# Altium project Cubesat_PDM.PrjPcb (part 2 of 3)

## Sheet 3V3_Supply.SchDoc
size 297 x 209 mm; SheetNumber: 7; SheetTotal: 11
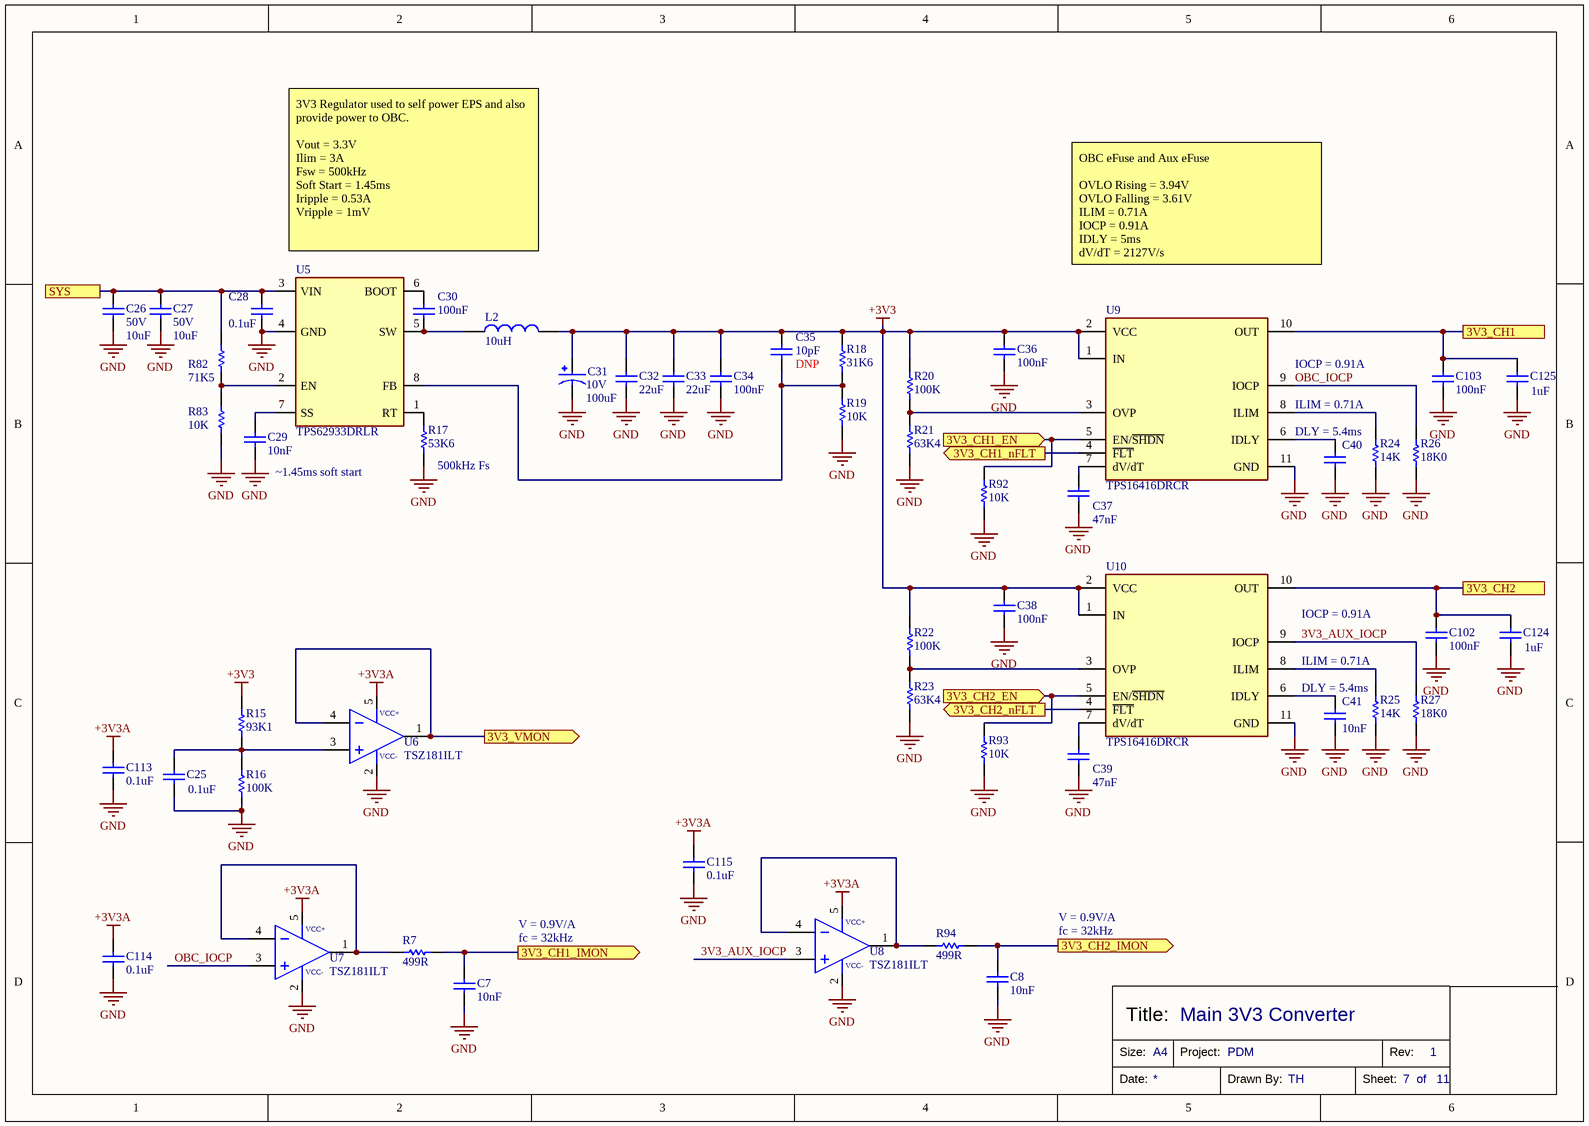
[diagram p5: 3V3_Supply.SchDoc]

### Parts
C7  Capacitance: 10nF  [CAPC0805X060]  (hidden comment: CL21B103KBANNNC)
C8  Capacitance: 10nF  [CAPC0805X060]  (hidden comment: CL21B103KBANNNC)
C25  Capacitance: 0.1uF  [CAPC0805X060]  (hidden comment: CL21B104KACNNNC)
C26  Voltage Rating: 50V  Capacitance: 10uF  [CAPC1210X090]  (hidden comment: CL32B106KBJNNNE)
C27  Voltage Rating: 50V  Capacitance: 10uF  [CAPC1210X090]  (hidden comment: CL32B106KBJNNNE)
C28  Capacitance: 0.1uF  [CAPC0402X020]  (hidden comment: CL05B104KB5NNNC)
C29  Capacitance: 10nF  [CAPC0805X060]  (hidden comment: CL21B103KBANNNC)
C30  Capacitance: 100nF  [CAPC0603X040]  (hidden comment: C0603C104K5RACTU)
C31  Voltage Rating: 10V  Capacitance: 100uF  [2312 Tantalum]  (hidden comment: TPSC107K010R0100)
C32  Capacitance: 22uF  [CAPC0805X060]  (hidden comment: GRM21BZ71A226ME15L)
C33  Capacitance: 22uF  [CAPC0805X060]  (hidden comment: GRM21BZ71A226ME15L)
C34  Capacitance: 100nF  [CAPC0603X040]  (hidden comment: C0603C104K5RACTU)
C35  Capacitance: 10pF  [CAPC0603X040]  (hidden comment: C0603C104K5RACTU)
C36  Capacitance: 100nF  [CAPC0603X040]  (hidden comment: C0603C104K5RACTU)
C37  Capacitance: 47nF  [CAPC0805X060]  (hidden comment: CL21B473KBCNNNC)
C38  Capacitance: 100nF  [CAPC0603X040]  (hidden comment: C0603C104K5RACTU)
C39  Capacitance: 47nF  [CAPC0805X060]  (hidden comment: CL21B473KBCNNNC)
C40  CL21B103KBANNNC  [CAPC0805X060]  (value not drawn)
C41  Capacitance: 10nF  [CAPC0805X060]  (hidden comment: CL21B103KBANNNC)
C102  Capacitance: 100nF  [CAPC0603X040]  (hidden comment: C0603C104K5RACTU)
C103  Capacitance: 100nF  [CAPC0603X040]  (hidden comment: C0603C104K5RACTU)
C113  Capacitance: 0.1uF  [CAPC0603X040]  (hidden comment: C0603C104K5RACTU)
C114  Capacitance: 0.1uF  [CAPC0603X040]  (hidden comment: C0603C104K5RACTU)
C115  Capacitance: 0.1uF  [CAPC0603X040]  (hidden comment: C0603C104K5RACTU)
C124  Capacitance: 1uF  [CAPC0805X060]  (hidden comment: CL21B105KAFNNNE)
C125  Capacitance: 1uF  [CAPC0805X060]  (hidden comment: CL21B105KAFNNNE)
L2  Inductance: 10uH  [1274AS-H-100M=P3]  (hidden comment: 1274AS-H-100M=P3)
R7  Resistance: 499R  [RESC0805]  (hidden comment: RMCF0805FT499R)
R15  Resistance: 93K1  [RESC0603]  (hidden comment: RMCF0603FT93K1)
R16  Resistance: 100K  [RESC0603]  (hidden comment: RMCF0603FT100K)
R17  Resistance: 53K6  [RESC0805]  (hidden comment: RMCF0805FT53K6)
R18  Resistance: 31K6  [RESC0603]  (hidden comment: RMCF0603FT31K6)
R19  Resistance: 10K  [RESC0603]  (hidden comment: RMCF0603FT10K0)
R20  Resistance: 100K  [RESC0805]  (hidden comment: RMCF0805FG100K)
R21  Resistance: 63K4  [RESC0805]  (hidden comment: RMCF0805FT63K4)
R22  Resistance: 100K  [RESC0805]  (hidden comment: RMCF0805FG100K)
R23  Resistance: 63K4  [RESC0805]  (hidden comment: RMCF0805FT63K4)
R24  Resistance: 14K  [RESC0805]  (hidden comment: RMCF0805FT14K0)
R25  Resistance: 14K  [RESC0805]  (hidden comment: RMCF0805FT14K0)
R26  Resistance: 18K0  [RESC0805]  (hidden comment: RMCF0805FT18K0)
R27  Resistance: 18K0  [RESC0805]  (hidden comment: RMCF0805FT18K0)
R82  Resistance: 71K5  [RESC0805]  (hidden comment: RMCF0805FT71K5)
R83  Resistance: 10K  [RESC0603]  (hidden comment: RMCF0603FT10K0)
R92  Resistance: 10K  [RESC0805]  (hidden comment: RMCF0805FT10K0)
R93  Resistance: 10K  [RESC0805]  (hidden comment: RMCF0805FT10K0)
R94  Resistance: 499R  [RESC0805]  (hidden comment: RMCF0805FT499R)
U5  TPS62933DRLR  [SOT-583]
U6  TSZ181ILT  [SOT23-5 IC]
U7  TSZ181ILT  [SOT23-5 IC]
U8  TSZ181ILT  [SOT23-5 IC]
U9  Part Number: TPS16416DRCR  [TPS1641]  (hidden comment: TPS16410DRCR)
U10  Part Number: TPS16416DRCR  [TPS1641]  (hidden comment: TPS16410DRCR)

### Ports
3V3_CH1 (see PDM[6A], PC104[4B], PC104[5B]), 3V3_CH1_EN (in, see PDM[5A], Controller[3D]), 3V3_CH1_IMON (out, see PDM[5A], Controller[1B]), 3V3_CH1_nFLT (out, see PDM[5A], Controller[3D]), 3V3_CH2 (see PDM[6A], PC104[4B], PC104[5B]), 3V3_CH2_EN (in, see PDM[5A], Controller[3D]), 3V3_CH2_IMON (out, see PDM[5A], Controller[1B]), 3V3_CH2_nFLT (out, see PDM[5A], Controller[3D]), 3V3_VMON (out, see PDM[5A], Controller[3B]), SYS (see PDM[5A], 5V_Supply[1A], 6V_Supply[1B], 12V_Supply[1A], PC104[4C], PC104[5C])

### Nets
+3V3: C31.1 C32.2 C33.2 C34.2 C35.2 C36.2 C38.2 L2.2 R15.2 R18.2 R20.2 R22.2 U9.1(IN) U9.2(VCC) U10.1(IN) U10.2(VCC)
+3V3A: C113.2 C114.2 C115.2 U6.5(VCC+) U7.5(VCC+) U8.5(VCC+)
GND: C7.1 C8.1 C25.1 C26.1 C27.1 C28.1 C29.1 C31.2 C32.1 C33.1 C34.1 C36.1 C37.1 C38.1 C39.1 C40.1 C41.1 C102.1 C103.1 C113.1 C114.1 C115.1 C124.1 C125.1 R16.1 R17.1 R19.1 R21.1 R23.1 R24.1 R25.1 R26.1 R27.1 R83.1 R92.1 R93.1 U5.4(GND) U6.2(VCC-) U7.2(VCC-) U8.2(VCC-) U9.11(GND) U10.11(GND)
3V3_AUX_IOCP: R27.2 U8.3(IN+) U10.9(IOCP)
OBC_IOCP: R26.2 U7.3(IN+) U9.9(IOCP)
NetC7_2: C7.2 R7.2 ; port 3V3_CH1_IMON
NetC8_2: C8.2 R94.2 ; port 3V3_CH2_IMON
NetC25_2: C25.2 R15.1 R16.2 U6.3(IN+)
NetC26_2: C26.2 C27.2 C28.2 R82.2 U5.3(VIN) ; port SYS
NetC29_2: C29.2 U5.7(SS)
NetC30_1: C30.1 L2.1 U5.5(SW)
NetC30_2: C30.2 U5.6(BOOT)
NetC35_1: C35.1 R18.1 R19.2 U5.8(FB)
NetC37_2: C37.2 U9.7(dV/dT)
NetC39_2: C39.2 U10.7(dV/dT)
NetC40_2: C40.2 U9.6(IDLY)
NetC41_2: C41.2 U10.6(IDLY)
NetC102_2: C102.2 C124.2 U10.10(OUT) ; port 3V3_CH2
NetC103_2: C103.2 C125.2 U9.10(OUT) ; port 3V3_CH1
NetR7_1: R7.1 U7.1(OUT) U7.4(IN-)
NetR17_2: R17.2 U5.1(RT)
NetR20_1: R20.1 R21.2 U9.3(OVP)
NetR22_1: R22.1 R23.2 U10.3(OVP)
NetR24_2: R24.2 U9.8(ILIM)
NetR25_2: R25.2 U10.8(ILIM)
NetR82_1: R82.1 R83.2 U5.2(EN)
NetR92_2: R92.2 U9.5(EN/~{SHDN}) ; port 3V3_CH1_EN
NetR93_2: R93.2 U10.5(EN/~{SHDN}) ; port 3V3_CH2_EN
NetR94_1: R94.1 U8.1(OUT) U8.4(IN-)
NetU3_35: U6.1(OUT) U6.4(IN-) ; port 3V3_VMON
NetU3_55: U10.4(~{FLT}) ; port 3V3_CH2_nFLT
NetU3_57: U9.4(~{FLT}) ; port 3V3_CH1_nFLT

### Notes on the sheet
- 3V3 Regulator used to self power EPS and also provide power to OBC.
  Vout = 3.3V
  Ilim = 3A
  Fsw = 500kHz
  Soft Start = 1.45ms
  Iripple = 0.53A
  Vripple = 1mV
- OBC eFuse and Aux eFuse
  OVLO Rising = 3.94V
  OVLO Falling = 3.61V
  ILIM = 0.71A
  IOCP = 0.91A
  IDLY = 5ms
  dV/dT = 2127V/s
- (near C35) DNP
- (near U9) IOCP = 0.91A
- ~1.45ms soft start
- (near R17) 500kHz Fs
- DLY = 5.4ms
- ILIM = 0.71A
- (near U10) IOCP = 0.91A
- V = 0.9V/A
- fc = 32kHz
- Main 3V3 Converter
- Size:
- Title:
- A4
- Project:
- Rev:
- Date:
- Drawn By:
- Sheet:
- of

### Library data of the parts
C7 C8 C29 C40 C41 = CL21B103KBANNNC: as C58 on sheet 12V_Supply; Part Number: CL21B103KBANNNC; Distributor Part Number: 1276-1015-1-ND; Tolerance: 10%; Case Code: 0805; Distributor: Digikey
C25 = CL21B104KACNNNC: as C54 on sheet 12V_Supply; Part Number: CL21B104KACNNNC; Distributor Part Number: 1276-1099-1-ND; Tolerance: 10%; Case Code: 0805; Distributor: Digikey; Voltage Rating: 25V
C26 C27 = CL32B106KBJNNNE: as C55 on sheet 12V_Supply; Manufacturer Part Number: CL32B106KBJNNNE; Distributor Part Number: 1276-3387-1-ND; Tolerance: 10%; Case Code: 1210; Distributor: Digikey
C28 = CL05B104KB5NNNC: as C5 on sheet Controller; Part Number: CL05B104KB5NNNC; Tolerance: 10%; Distributor Part Number: 1276-CL05B104KB5NNNCCT-ND; Case Code: 0402; Distributor: Digikey; Voltage Rating: 50V
C30 C34 C36 C38 C102 C103 C113-C115 = C0603C104K5RACTU: as C16 on sheet Controller; Distributor Part Number: 399-C0603C104K5RACTUCT-ND; Tolerance: 10%; Case Code: 0603; Distributor: Digikey; Voltage Rating: 50V
  C30: Manufacturer Part Number: C0603C104K5RACTU
  C34 C36 C38 C102 C103 C113-C115: Part Number: C0603C104K5RACTU
C31 = TPSC107K010R0100: 100 µF Molded Tantalum Capacitors 10 V 2312 (6032 Metric) 100mOhm; Part Number: TPSC107K010R0100; Distributor: Digikey; Distributor Part Number: 478-1765-1-ND; ESR: 100mOhm; Operating Temperature: -55°C ~ 125°C
C32 C33 = GRM21BZ71A226ME15L: 22 µF ±20% 10V Ceramic Capacitor X7R 0805 (2012 Metric); Tolerance: 10%; Part Number: GRM21BZ71A226ME15L; Distributor Part Number: 490-GRM21BZ71A226ME15LCT-ND; Case Code: 0805; Distributor: Digikey; Voltage Rating: 10V
C35 = C0603C100J5GACTU: as C64 on sheet 12V_Supply; Part Number: C0603C100J5GACTU; Distributor Part Number: 399-C0603C100J5GACTUCT-ND; Case Code: 0603; Distributor: Digikey; Voltage Rating: 50V
C37 C39 = CL21B473KBCNNNC: as C67 on sheet 12V_Supply; Part Number: CL21B473KBCNNNC; Distributor Part Number: 1276-1250-1-ND; Tolerance: 10%; Case Code: 0805; Distributor: Digikey
C124 C125 = CL21B105KAFNNNE: as C109 on sheet 12V_Supply; Part Number: CL21B105KAFNNNE; Distributor Part Number: 1276-1066-1-ND; Tolerance: 10%; Case Code: 0805; Distributor: Digikey; Voltage Rating: 25V
L2 = 1274AS-H-100M=P3: as L4 on sheet 12V_Supply; Part Number: 1274AS-H-100M=P3; Distributor Part Number: 490-10846-1-ND; Distributor: Digikey; DCR: 30.4mOhm
R7 R94 = RMCF0805FT499R: as R96 on sheet 12V_Supply; Part Number: RMCF0805FT499R; Tolerance: 1%; Distributor Part Number: RMCF0805FT499RCT-ND; Distributor: Digikey; Case Code: 0805
R15 = RMCF0603FT93K1: 93.1 kOhms ±1% 0.1W, 1/10W Chip Resistor 0603 (1608 Metric) Automotive AEC-Q200 Thick Film; Part Number: RMCF0603FT93K1; Tolerance: 1%; Distributor: Digikey; Distributor Part Number: RMCF0603FT93K1CT-ND; Case Code: 0603
R16 = RMCF0603FT100K: 100 kOhms ±1% 0.1W, 1/10W Chip Resistor 0603 (1608 Metric) Automotive AEC-Q200 Thick Film; Part Number: RMCF0603FT100K; Tolerance: 1%; Distributor: Digikey; Distributor Part Number: RMCF0603FT100KCT-ND; Case Code: 0603
R17 = RMCF0805FT53K6: as R44 on sheet 12V_Supply; Part Number: RMCF0805FT53K6; Tolerance: 1%; Distributor Part Number: RMCF0805FT53K6CT-ND; Distributor: Digikey; Case Code: 0805
R18 = RMCF0603FT31K6: 31.6 kOhms ±1% 0.1W, 1/10W Chip Resistor 0603 (1608 Metric) Automotive AEC-Q200 Thick Film; Part Number: RMCF0603FT31K6; Tolerance: 1%; Distributor: Digikey; Distributor Part Number: RMCF0603FT31K6CT-ND; Case Code: 0603
R19 R83 = RMCF0603FT10K0: as R74 on sheet I2C_Buffer; Tolerance: 1%; Distributor Part Number: RMCF0603FT10K0CT-ND; Distributor: Digikey; Case Code: 0603; Part Number: RMCF0603FT10K0
R20 R22 = RMCF0805FG100K: as R47 on sheet 12V_Supply; Part Number: RMCF0805FG100K; Tolerance: 1%; Distributor Part Number: RMCF0805FG100KCT-ND; Distributor: Digikey; Case Code: 0805
R21 R23 = RMCF0805FT63K4: 63.4 kOhms ±1% 0.125W, 1/8W Chip Resistor 0805 (2012 Metric) Automotive AEC-Q200 Thick Film; Part Number: RMCF0805FT63K4; Tolerance: 1%; Distributor Part Number: RMCF0805FT63K4CT-ND; Distributor: Digikey; Case Code: 0805
R24 R25 = RMCF0805FT14K0: 14 kOhms ±1% 0.125W, 1/8W Chip Resistor 0805 (2012 Metric) Automotive AEC-Q200 Thick Film; Part Number: RMCF0805FT14K0; Tolerance: 1%; Distributor Part Number: RMCF0805FT14K0CT-ND; Distributor: Digikey; Case Code: 0805
R26 R27 = RMCF0805FT18K0: 18 kOhms ±1% 0.125W, 1/8W Chip Resistor 0805 (2012 Metric) Automotive AEC-Q200 Thick Film; Part Number: RMCF0805FT18K0; Tolerance: 1%; Distributor Part Number: RMCF0805FT18K0CT-ND; Distributor: Digikey; Case Code: 0805
R82 = RMCF0805FT71K5: 71.5 kOhms ±1% 0.125W, 1/8W Chip Resistor 0805 (2012 Metric) Automotive AEC-Q200 Thick Film; Part Number: RMCF0805FT71K5; Tolerance: 1%; Distributor Part Number: RMCF0805FT71K5CT-ND; Distributor: Digikey; Case Code: 0805
R92 R93 = RMCF0805FT10K0: as R8 on sheet Controller; Part Number: RMCF0805FT10K0; Tolerance: 1%; Distributor Part Number: RMCF0805FT10K0CT-ND; Distributor: Digikey; Case Code: 0805
U5 = TPS62933DRLR: as U15 on sheet 12V_Supply; Part Number: TPS62933DRLR; Distributor Part Number: 296-TPS62933DRLRCT-ND; Distributor: Digikey; Operating Temperature: -40°C ~ 150°C (TJ); Current Output: 3A; Voltage - Output (Min): 0.8V
U6-U8 = TSZ181ILT: as U16 on sheet 12V_Supply; Part Number: TSZ181ILT; Distributor: Digikey; Distributor Part Number: 497-18084-1-ND; Operating Temperature: -40°C ~ 125°C
U9 U10 = TPS16410DRCR: as U19 on sheet 12V_Supply; Distributor Part Number: 296-TPS16410DRCRCT-ND; Package: 10-VSON (3x3); Distributor: Digikey; Operating Temperature: -40C ~ 125C

## Sheet 6V_Supply.SchDoc
size 297 x 209 mm; SheetNumber: 6; SheetTotal: 11
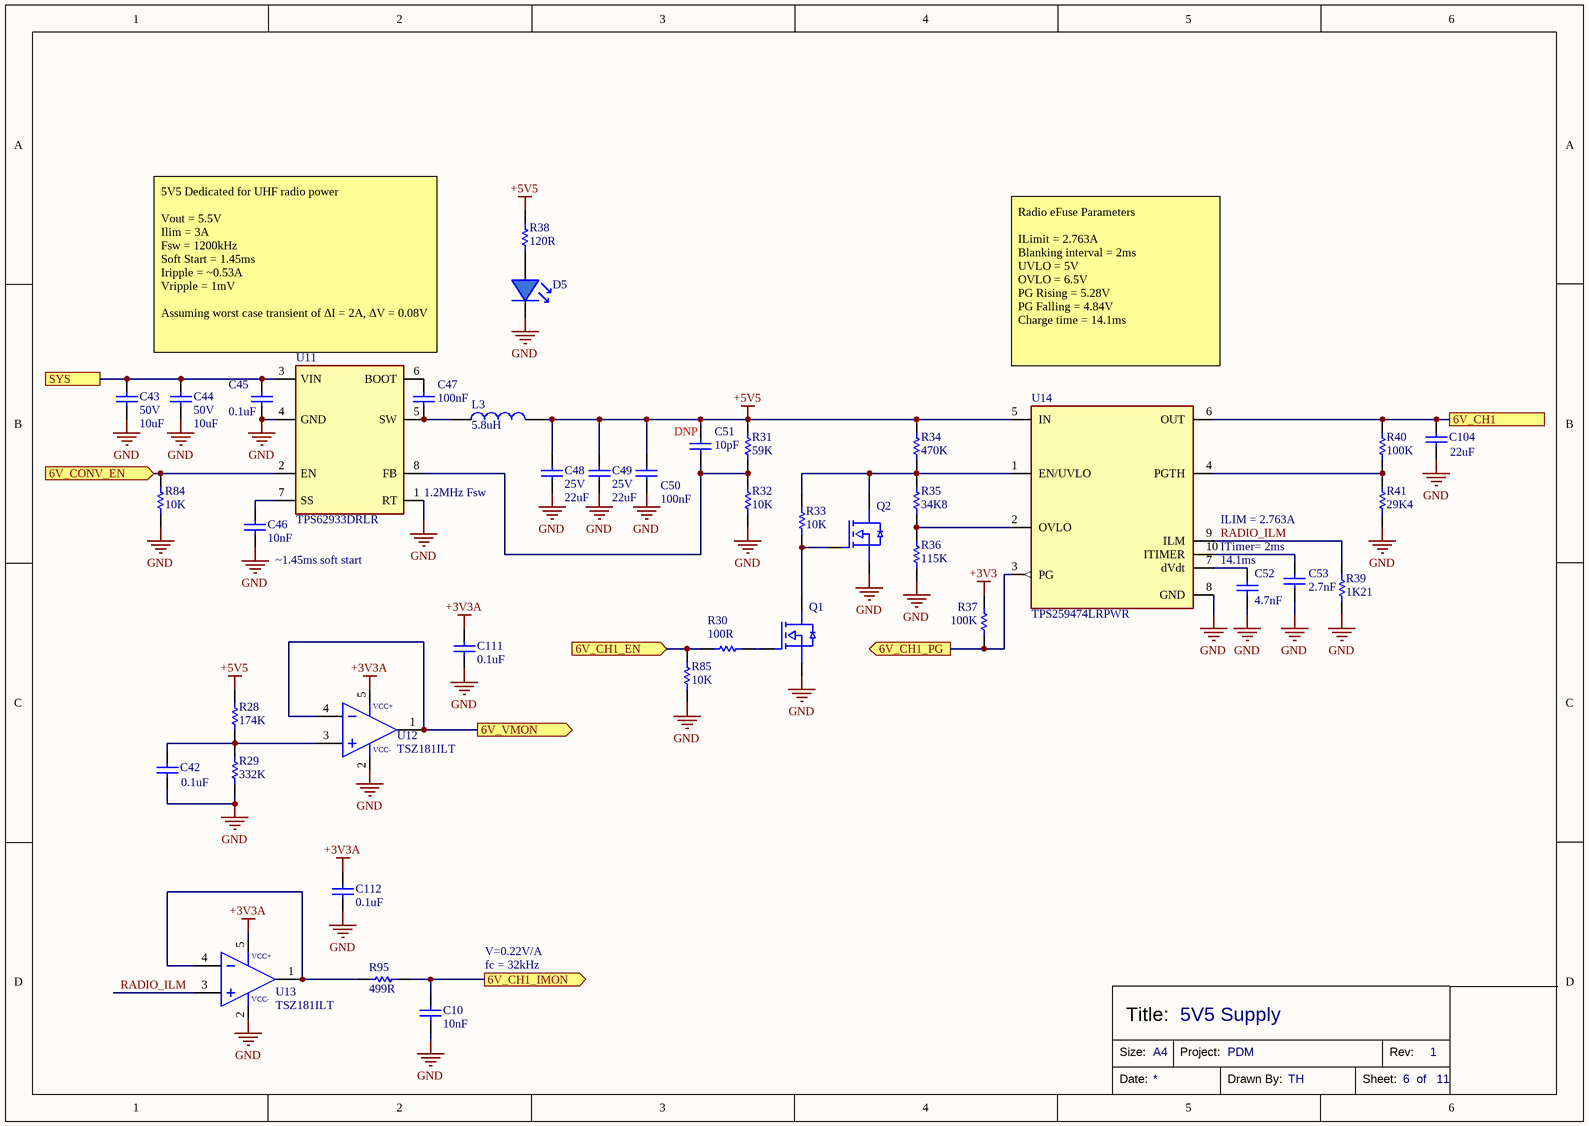
[diagram p6: 6V_Supply.SchDoc]

### Parts
C10  Capacitance: 10nF  [CAPC0805X060]  (hidden comment: CL21B103KBANNNC)
C42  Capacitance: 0.1uF  [CAPC0805X060]  (hidden comment: CL21B104KACNNNC)
C43  Voltage Rating: 50V  Capacitance: 10uF  [CAPC1210X090]  (hidden comment: CL32B106KBJNNNE)
C44  Voltage Rating: 50V  Capacitance: 10uF  [CAPC1210X090]  (hidden comment: CL32B106KBJNNNE)
C45  Capacitance: 0.1uF  [CAPC0402X020]  (hidden comment: CL05B104KB5NNNC)
C46  Capacitance: 10nF  [CAPC0805X060]  (hidden comment: CL21B103KBANNNC)
C47  Capacitance: 100nF  [CAPC0603X040]  (hidden comment: C0603C104K5RACTU)
C48  Voltage Rating: 25V  Capacitance: 22uF  [CAPC1210X090]  (hidden comment: CL32B226KAJNNNE)
C49  Voltage Rating: 25V  Capacitance: 22uF  [CAPC1210X090]  (hidden comment: CL32B226KAJNNNE)
C50  Capacitance: 100nF  [CAPC0603X040]  (hidden comment: C0603C104K5RACTU)
C51  Capacitance: 10pF  [CAPC0603X040]  (hidden comment: C0603C104K5RACTU)
C52  Capacitance: 4.7nF  [CAPC0805X060]  (hidden comment: CL21B105KAFNNNE)
C53  Capacitance: 2.7nF  [CAPC0805X060]  (hidden comment: GRM2165C1H272JA01D)
C104  Capacitance: 22uF  [CAPC1210X090]  (hidden comment: CL32B226MOJNNNE)
C111  Capacitance: 0.1uF  [CAPC0603X040]  (hidden comment: C0603C104K5RACTU)
C112  Capacitance: 0.1uF  [CAPC0603X040]  (hidden comment: C0603C104K5RACTU)
D5  LSM0805463V  [LEDB_0805]  (value not drawn)
L3  744316560  [744316560]  (value not drawn)
Q1  T2N7002AK,LM  [SOT23-3 MOSFET]  (value not drawn)
Q2  T2N7002AK,LM  [SOT23-3 MOSFET]  (value not drawn)
R28  Resistance: 174K  [RESC0603]  (hidden comment: RMCF0603FT174K)
R29  Resistance: 332K  [RESC0805]  (hidden comment: RMCF0805FT332K)
R30  Resistance: 100R  [RESC0805]  (hidden comment: RMCF0805FT100R)
R31  Resistance: 59K  [RESC0603]  (hidden comment: RMCF0603FT59K0)
R32  Resistance: 10K  [RESC0603]  (hidden comment: RMCF0603FT10K0)
R33  Resistance: 10K  [RESC0805]  (hidden comment: RMCF0805FT10K0)
R34  Resistance: 470K  [RESC0603]  (hidden comment: RMCF0603FT470K)
R35  Resistance: 34K8  [RESC0805]  (hidden comment: RMCF0805FT34K8)
R36  Resistance: 115K  [RESC0805]  (hidden comment: RMCF0805FT115K)
R37  Resistance: 100K  [RESC0805]  (hidden comment: RMCF0805FG100K)
R38  Resistance: 120R  [RESC0805]  (hidden comment: RMCF0805FT120R)
R39  Resistance: 1K21  [RESC0805]  (hidden comment: RMCF0805FT1K21)
R40  Resistance: 100K  [RESC0805]  (hidden comment: RMCF0805FG100K)
R41  Resistance: 29K4  [RESC0805]  (hidden comment: RMCF0805FT29K4)
R84  Resistance: 10K  [RESC0805]  (hidden comment: RMCF0805FT10K0)
R85  Resistance: 10K  [RESC0805]  (hidden comment: RMCF0805FT10K0)
R95  Resistance: 499R  [RESC0805]  (hidden comment: RMCF0805FT499R)
U11  TPS62933DRLR  [SOT-583]
U12  TSZ181ILT  [SOT23-5 IC]
U13  TSZ181ILT  [SOT23-5 IC]
U14  TPS259474LRPWR  [VFQFN-10]

### Ports
6V_CH1 (see PDM[6B], PC104[4C], PC104[5C]), 6V_CH1_EN (in, see PDM[5C], Controller[3C]), 6V_CH1_IMON (out, see PDM[5C], Controller[1B]), 6V_CH1_PG (out, see PDM[5C], Controller[3C]), 6V_CONV_EN (in, see PDM[5C], Controller[3B]), 6V_VMON (out, see PDM[5C], Controller[1B]), SYS (see PDM[5B], 3V3_Supply[1B], 5V_Supply[1A], 12V_Supply[1A], PC104[4C], PC104[5C])

### Nets
+3V3: R37.2
+3V3A: C111.2 C112.2 U12.5(VCC+) U13.5(VCC+)
+5V5: C48.2 C49.2 C50.2 C51.2 L3.2 R28.2 R31.2 R34.2 R38.2 U14.5(IN)
GND: C10.1 C42.1 C43.1 C44.1 C45.1 C46.1 C48.1 C49.1 C50.1 C52.1 C53.1 C104.1 C111.1 C112.1 D5.K Q1.S Q2.S R29.1 R32.1 R36.1 R39.1 R41.1 R84.1 R85.1 U11.1(RT) U11.4(GND) U12.2(VCC-) U13.2(VCC-) U14.8(GND)
RADIO_ILM: R39.2 U13.3(IN+) U14.9(ILM)
NetC10_2: C10.2 R95.2 ; port 6V_CH1_IMON
NetC26_2: C43.2 C44.2 C45.2 U11.3(VIN) ; port SYS
NetC42_2: C42.2 R28.1 R29.2 U12.3(IN+)
NetC46_2: C46.2 U11.7(SS)
NetC47_1: C47.1 L3.1 U11.5(SW)
NetC47_2: C47.2 U11.6(BOOT)
NetC51_1: C51.1 R31.1 R32.2 U11.8(FB)
NetC52_2: C52.2 U14.7(dVdt)
NetC53_2: C53.2 U14.10(ITIMER)
NetC104_2: C104.2 R40.2 U14.6(OUT) ; port 6V_CH1
NetD5_A: D5.A R38.1
NetQ1_D: Q1.D Q2.G R33.1
NetQ1_G: Q1.G R30.1
NetQ2_D: Q2.D R33.2 R34.1 R35.2 U14.1(EN/UVLO)
NetR30_2: R30.2 R85.2 ; port 6V_CH1_EN
NetR35_1: R35.1 R36.2 U14.2(OVLO)
NetR37_1: R37.1 U14.3(PG) ; port 6V_CH1_PG
NetR40_1: R40.1 R41.2 U14.4(PGTH)
NetR84_2: R84.2 U11.2(EN) ; port 6V_CONV_EN
NetR95_1: R95.1 U13.1(OUT) U13.4(IN-)
NetU3_23: U12.1(OUT) U12.4(IN-) ; port 6V_VMON

### Notes on the sheet
- 5V5 Dedicated for UHF radio power
  Vout = 5.5V
  Ilim = 3A
  Fsw = 1200kHz
  Soft Start = 1.45ms
  Iripple = ~0.53A
  Vripple = 1mV
  Assuming worst case transient of ΔI = 2A, ΔV = 0.08V
- Radio eFuse Parameters
  ILimit = 2.763A
  Blanking interval = 2ms
  UVLO = 5V
  OVLO = 6.5V
  PG Rising = 5.28V
  PG Falling = 4.84V
  Charge time = 14.1ms
- (near L3) 5.8uH
- (near C51) DNP
- (near U11) 1.2MHz Fsw
- (near U14) ILIM = 2.763A
- (near C46) ~1.45ms soft start
- ITimer= 2ms
- (near C52) 14.1ms
- V=0.22V/A
- fc = 32kHz
- 5V5 Supply
- Size:
- Title:
- A4
- Project:
- Rev:
- Date:
- Drawn By:
- Sheet:
- of

### Library data of the parts
C10 C46 = CL21B103KBANNNC: as C58 on sheet 12V_Supply; Part Number: CL21B103KBANNNC; Distributor Part Number: 1276-1015-1-ND; Tolerance: 10%; Case Code: 0805; Distributor: Digikey
C42 = CL21B104KACNNNC: as C54 on sheet 12V_Supply; Part Number: CL21B104KACNNNC; Distributor Part Number: 1276-1099-1-ND; Tolerance: 10%; Case Code: 0805; Distributor: Digikey; Voltage Rating: 25V
C43 C44 = CL32B106KBJNNNE: as C55 on sheet 12V_Supply; Manufacturer Part Number: CL32B106KBJNNNE; Distributor Part Number: 1276-3387-1-ND; Tolerance: 10%; Case Code: 1210; Distributor: Digikey
C45 = CL05B104KB5NNNC: as C5 on sheet Controller; Part Number: CL05B104KB5NNNC; Tolerance: 10%; Distributor Part Number: 1276-CL05B104KB5NNNCCT-ND; Case Code: 0402; Distributor: Digikey; Voltage Rating: 50V
C47 C50 C111 C112 = C0603C104K5RACTU: as C16 on sheet Controller; Distributor Part Number: 399-C0603C104K5RACTUCT-ND; Tolerance: 10%; Case Code: 0603; Distributor: Digikey; Voltage Rating: 50V
  C47: Manufacturer Part Number: C0603C104K5RACTU
  C50 C111 C112: Part Number: C0603C104K5RACTU
C48 C49 = CL32B226KAJNNNE: as C60 on sheet 12V_Supply; Part Number: CL32B226KAJNNNE; Distributor Part Number: 1276-3392-1-ND; Tolerance: 10%; Case Code: 1210; Distributor: Digikey
C51 = C0603C100J5GACTU: as C64 on sheet 12V_Supply; Part Number: C0603C100J5GACTU; Distributor Part Number: 399-C0603C100J5GACTUCT-ND; Case Code: 0603; Distributor: Digikey; Voltage Rating: 50V
C52 = CL21B472KBANNNC: 4.7nF ±10% 50V Ceramic Capacitor X7R 0805 (2012 Metric); Voltage Rating: 25V; Part Number: CL21B472KBANNNC; Distributor Part Number: 1276-1155-1-ND; Tolerance: 10%; Case Code: 0805; Distributor: Digikey
C53 = GRM2165C1H272JA01D: 2.7nF ±5% 50V Ceramic Capacitor C0G, NP0 0805 (2012 Metric); Manufacturer Part Number: GRM2165C1H272JA01D; Distributor Part Number: 490-1630-1-ND; Tolerance: 5%; Case Code: 0805; Distributor: Digikey; Voltage Rating: 50V
C104 = CL32B226MOJNNNE: 22 µF ±20% 16V Ceramic Capacitor X7R 1210 (3225 Metric); Tolerance: 10%; Voltage Rating: 50V; Part Number: CL32B226MOJNNNE; Distributor Part Number: 1276-3395-1-ND; Case Code: 1210; Distributor: Digikey
D5 = LEDB0805: as D6 on sheet 12V_Supply; Manufacturer Part Number: LSM0805463V; Distributor Part Number: 28-LSM0805463VCT-ND; Colour: Blue; Operating Temperature: *; Voltage - Forward: 3V; Distributor: Digikey
L3 = 744316560: Inductor 5.6uH 4.5A Shielded 28.5mOhm SMD; Saturation Current: 4.6A; Part Number: 744316560; Distributor Part Number: 732-6183-1-ND; Distributor: Digikey; Current Rating: 4.5A; DCR: 28.5mOhm
Q1 Q2 = T2N7002AK,LM: N-Channel 60 V 200mA (Ta) 320mW (Ta) Surface Mount SOT-23-3; Drain to Source Voltage: 60V; Rds On (Max) @ Id, Vgs: 3.9ohm; Vgs(th) (Max) @ Id: 2.1V @ 250µA; (Id) @ 25°C: 200mA; Vgs (Max): *; Power Dissipation (Max): 320mW (Ta); Operating Temperature: -55C - 150C; Manufacturer Part Number: T2N7002AK,LM; Part Number: T2N7002AK,LM; Distributor: Digikey; Distributor Part Number: T2N7002AKLMCT-ND
R28 = RMCF0603FT174K: 174 kOhms ±1% 0.1W, 1/10W Chip Resistor 0603 (1608 Metric) Automotive AEC-Q200 Thick Film; Manufacturer Part Number: RMCF0603FT174K; Tolerance: 1%; Distributor: Digikey; Distributor Part Number: RMCF0603FT174KCT-ND; Case Code: 0603
R29 = RMCF0805FT332K: as R42 on sheet 12V_Supply; Part Number: RMCF0805FT332K; Tolerance: 1%; Distributor Part Number: RMCF0805FT332KCT-ND; Distributor: Digikey; Case Code: 0805
R30 = RMCF0805FT100R: 100 Ohms ±1% 0.125W, 1/8W Chip Resistor 0805 (2012 Metric) Automotive AEC-Q200 Thick Film; Part Number: RMCF0805FT100R; Tolerance: 1%; Distributor Part Number: RMCF0805FT100RCT-ND; Distributor: Digikey; Case Code: 0805
R31 = RMCF0603FT59K0: 59 kOhms ±1% 0.1W, 1/10W Chip Resistor 0603 (1608 Metric) Automotive AEC-Q200 Thick Film; Part Number: RMCF0603FT59K0; Tolerance: 1%; Distributor Part Number: RMCF0603FT59K0CT-ND; Distributor: Digikey; Case Code: 0603
R32 = RMCF0603FT10K0: as R74 on sheet I2C_Buffer; Tolerance: 1%; Distributor Part Number: RMCF0603FT10K0CT-ND; Distributor: Digikey; Case Code: 0603; Part Number: RMCF0603FT10K0
R33 R84 R85 = RMCF0805FT10K0: as R8 on sheet Controller; Part Number: RMCF0805FT10K0; Tolerance: 1%; Distributor Part Number: RMCF0805FT10K0CT-ND; Distributor: Digikey; Case Code: 0805
R34 = RMCF0603FT470K: 470 kOhms ±1% 0.1W, 1/10W Chip Resistor 0603 (1608 Metric) Automotive AEC-Q200 Thick Film; Part Number: RMCF0603FT470K; Tolerance: 1%; Distributor: Digikey; Distributor Part Number: RMCF0603FT470KCT-ND; Case Code: 0603
R35 = RMCF0805FT34K8: 34.8 kOhms ±1% 0.125W, 1/8W Chip Resistor 0805 (2012 Metric) Automotive AEC-Q200 Thick Film; Part Number: RMCF0805FT34K8; Tolerance: 1%; Distributor Part Number: RMCF0805FT34K8CT-ND; Distributor: Digikey; Case Code: 0805
R36 = RMCF0805FT115K: 115 kOhms ±1% 0.125W, 1/8W Chip Resistor 0805 (2012 Metric) Automotive AEC-Q200 Thick Film; Part Number: RMCF0805FT115K; Tolerance: 1%; Distributor Part Number: RMCF0805FT115KCT-ND; Distributor: Digikey; Case Code: 0805
R37 R40 = RMCF0805FG100K: as R47 on sheet 12V_Supply; Part Number: RMCF0805FG100K; Tolerance: 1%; Distributor Part Number: RMCF0805FG100KCT-ND; Distributor: Digikey; Case Code: 0805
R38 = RMCF0805FT120R: as R12 on sheet Controller; Part Number: RMCF0805FT120R; Tolerance: 1%; Distributor Part Number: 738-RMCF0805FT120RCT-ND; Distributor: Digikey; Case Code: 0805
R39 = RMCF0805FT1K21: 1.21 kOhms ±1% 0.125W, 1/8W Chip Resistor 0805 (2012 Metric) Automotive AEC-Q200 Thick Film; Part Number: RMCF0805FT1K21; Tolerance: 1%; Distributor Part Number: RMCF0805FT1K21CT-ND; Distributor: Digikey; Case Code: 0805
R41 = RMCF0805FT29K4: 29.4 kOhms ±1% 0.125W, 1/8W Chip Resistor 0805 (2012 Metric) Automotive AEC-Q200 Thick Film; Part Number: RMCF0805FT29K4; Tolerance: 1%; Distributor Part Number: RMCF0805FT29K4CT-ND; Distributor: Digikey; Case Code: 0805
R95 = RMCF0805FT499R: as R96 on sheet 12V_Supply; Part Number: RMCF0805FT499R; Tolerance: 1%; Distributor Part Number: RMCF0805FT499RCT-ND; Distributor: Digikey; Case Code: 0805
U11 = TPS62933DRLR: as U15 on sheet 12V_Supply; Part Number: TPS62933DRLR; Distributor Part Number: 296-TPS62933DRLRCT-ND; Distributor: Digikey; Operating Temperature: -40°C ~ 150°C (TJ); Current Output: 3A; Voltage - Output (Min): 0.8V
U12 U13 = TSZ181ILT: as U16 on sheet 12V_Supply; Part Number: TSZ181ILT; Distributor: Digikey; Distributor Part Number: 497-18084-1-ND; Operating Temperature: -40°C ~ 125°C
U14 = TPS259474LRPWR: eFuse 5.5A, 2.7V~23V, 28mOhm, Reverse Current Blocking with Input Reverse Polarity Protection; Part Number: TPS259474LRPWR; Distributor: Digikey; Distributor Part Number: 296-TPS259474LRPWRCT-ND; Operating Temperature: -40°C ~ 125°C; Output Current: 5.5A; Voltage Input: 2.7V~23V

## Sheet Ideal_Diode.SchDoc
size 297 x 209 mm; SheetNumber: 3; SheetTotal: 11
Used 4 times, as channels PDM/Ideal_Diode0, PDM/Ideal_Diode1, PDM/Ideal_Diode2, PDM/Ideal_Diode3. Parts and nets are listed once, with the designators drawn on the sheet.
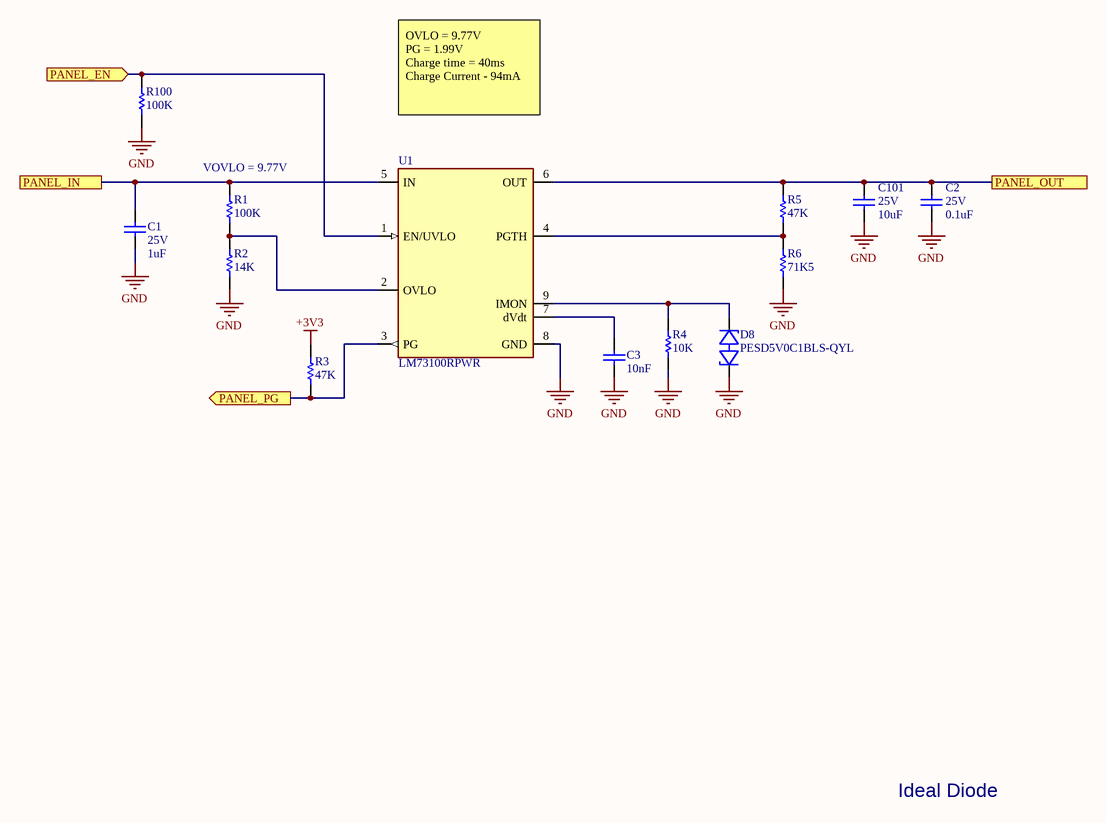
[diagram p7: Ideal_Diode.SchDoc]

### Parts
C1  Voltage Rating: 25V  Capacitance: 1uF  [CAPC0805X060]  (hidden comment: CL21B105KAFNNNE)
C2  Voltage Rating: 25V  Capacitance: 0.1uF  [CAPC0805X060]  (hidden comment: CL21B104KACNNNC)
C3  Capacitance: 10nF  [CAPC0805X060]  (hidden comment: CL21B103KBANNNC)
C101  Voltage Rating: 25V  Capacitance: 10uF  [CAPC0805X060]  (hidden comment: GRM21BZ71E106KE15L)
D8  PESD5V0C1BLS-QYL  [PESD5V0C1BLS-Q]
R1  Resistance: 100K  [RESC0805]  (hidden comment: RMCF0805FG100K)
R2  Resistance: 14K  [RESC0805]  (hidden comment: RMCF0805FT14K0)
R3  Resistance: 47K  [RESC0805]  (hidden comment: RMCF0805FT47K0)
R4  Resistance: 10K  [RESC0805]  (hidden comment: RMCF0805FT10K0)
R5  Resistance: 47K  [RESC0805]  (hidden comment: RMCF0805FT47K0)
R6  Resistance: 71K5  [RESC0805]  (hidden comment: RMCF0805FT71K5)
R100  Resistance: 100K  [RESC0805]  (hidden comment: RMCF0805FG100K)
U1  LM73100RPWR  [VFQFN-10]

### Ports
PANEL_EN (in, see PDM[2B]), PANEL_IN (see PDM[2B]), PANEL_OUT (see PDM[1B]), PANEL_PG (out, see PDM[2B])

### Nets
+3V3: R3.2
GND: C1.1 C2.1 C3.1 C101.1 D8.1 R2.1 R4.1 R6.1 R100.1 U1.8(GND)
PANEL_EN: R100.2 U1.1(EN/UVLO) ; port PANEL_EN
PANEL_IN: C1.2 R1.2 U1.5(IN) ; port PANEL_IN
PANEL_OUT: C2.2 C101.2 R5.2 U1.6(OUT) ; port PANEL_OUT
PANEL_PG: R3.1 U1.3(PG) ; port PANEL_PG
NetC3_2: C3.2 U1.7(dVdt)
NetD8_2: D8.2 R4.2 U1.9(IMON)
NetR1_1: R1.1 R2.2 U1.2(OVLO)
NetR5_1: R5.1 R6.2 U1.4(PGTH)

### Channels
PDM/Ideal_Diode0: designators end in A; ports PANEL_EN=NetR100A_2 PANEL_IN=NetC1A_2 PANEL_OUT=NetC2A_2 PANEL_PG=NetR3A_1
PDM/Ideal_Diode1: designators end in B; ports PANEL_EN=NetR100A_2 PANEL_IN=NetC1A_2 PANEL_OUT=NetC2A_2 PANEL_PG=NetR3A_1
PDM/Ideal_Diode2: designators end in C; ports PANEL_EN=NetR100A_2 PANEL_IN=NetC1A_2 PANEL_OUT=NetC2A_2 PANEL_PG=NetR3A_1
PDM/Ideal_Diode3: designators end in D; ports PANEL_EN=NetR100A_2 PANEL_IN=NetC1A_2 PANEL_OUT=NetC2A_2 PANEL_PG=NetR3A_1

### Notes on the sheet
- OVLO = 9.77V
  PG = 1.99V
  Charge time = 40ms
  Charge Current - 94mA
- (near R1) VOVLO = 9.77V
- Ideal Diode
- Size:
- Title:
- A4
- Project:
- Rev:
- Date:
- Drawn By:
- Sheet:
- of

### Library data of the parts
C1 = CL21B105KAFNNNE: as C109 on sheet 12V_Supply; Part Number: CL21B105KAFNNNE; Distributor Part Number: 1276-1066-1-ND; Tolerance: 10%; Case Code: 0805; Distributor: Digikey
C2 = CL21B104KACNNNC: as C54 on sheet 12V_Supply; Part Number: CL21B104KACNNNC; Distributor Part Number: 1276-1099-1-ND; Tolerance: 10%; Case Code: 0805; Distributor: Digikey
C3 = CL21B103KBANNNC: as C58 on sheet 12V_Supply; Part Number: CL21B103KBANNNC; Distributor Part Number: 1276-1015-1-ND; Tolerance: 10%; Case Code: 0805; Distributor: Digikey
C101 = GRM21BZ71E106KE15L: 10uF ±10% 25V Ceramic Capacitor X7R 0805 (2012 Metric); Manufacturer Part Number: GRM21BZ71E106KE15L; Distributor Part Number: 490-GRM21BZ71E106KE15LCT-ND; Tolerance: 10%; Case Code: 0805; Distributor: Digikey
D8 = PESD5V0C1BLS-QYL: 5.4V (Typ) Clamp 6.5A (8/20µs) Ipp Tvs Diode Surface Mount DFN1006BD-2; Voltage - Reverse Standoff (Typ): 5V (Max); Voltage - Breakdown (Min): 7.5V; Part Number: PESD5V0C1BLS-QYL; Voltage - Clamping (Max) @ Ipp: 5.4V (Typ); Operating Temperature: -55C ~ 150C; ComponentLink1Description: Datasheet; ComponentLink1URL: https://assets.nexperia.com/documents/data-sheet/PESD5V0C1BLS-Q.pdf; Distributor: Digikey; Distributor Part Number: 1727-PESD5V0C1BLS-QYLCT-ND
R1 R100 = RMCF0805FG100K: as R47 on sheet 12V_Supply; Part Number: RMCF0805FG100K; Tolerance: 1%; Distributor Part Number: RMCF0805FG100KCT-ND; Distributor: Digikey; Case Code: 0805
R2 = RMCF0805FT14K0: as R24 on sheet 3V3_Supply; Part Number: RMCF0805FT14K0; Tolerance: 1%; Distributor Part Number: RMCF0805FT14K0CT-ND; Distributor: Digikey; Case Code: 0805
R3 R5 = RMCF0805FT47K0: 47 kOhms ±1% 0.125W, 1/8W Chip Resistor 0805 (2012 Metric) Automotive AEC-Q200 Thick Film; Part Number: RMCF0805FT47K0; Tolerance: 1%; Distributor Part Number: RMCF0805FT47K0CT-ND; Distributor: Digikey; Case Code: 0805
R4 = RMCF0805FT10K0: as R8 on sheet Controller; Part Number: RMCF0805FT10K0; Tolerance: 1%; Distributor Part Number: RMCF0805FT10K0CT-ND; Distributor: Digikey; Case Code: 0805
R6 = RMCF0805FT71K5: as R82 on sheet 3V3_Supply; Part Number: RMCF0805FT71K5; Tolerance: 1%; Distributor Part Number: RMCF0805FT71K5CT-ND; Distributor: Digikey; Case Code: 0805
U1 = LM73100RPWR: Ideal Diode 2.7 - 23 V, 5.5 A with Input Reverse Polarity and / Overvoltage Protection; Current Output: 5.5A; Voltage Supply: 2.7V ~ 23V; Part Number: LM73100RPWR; Distributor Part Number: 296-LM73100RPWRCT-ND; Distributor: Digikey; Operating Temperature: -40°C ~ 125°C (TJ)

## Sheet 5V_Supply.SchDoc
size 297 x 209 mm; SheetNumber: 9; SheetTotal: 11
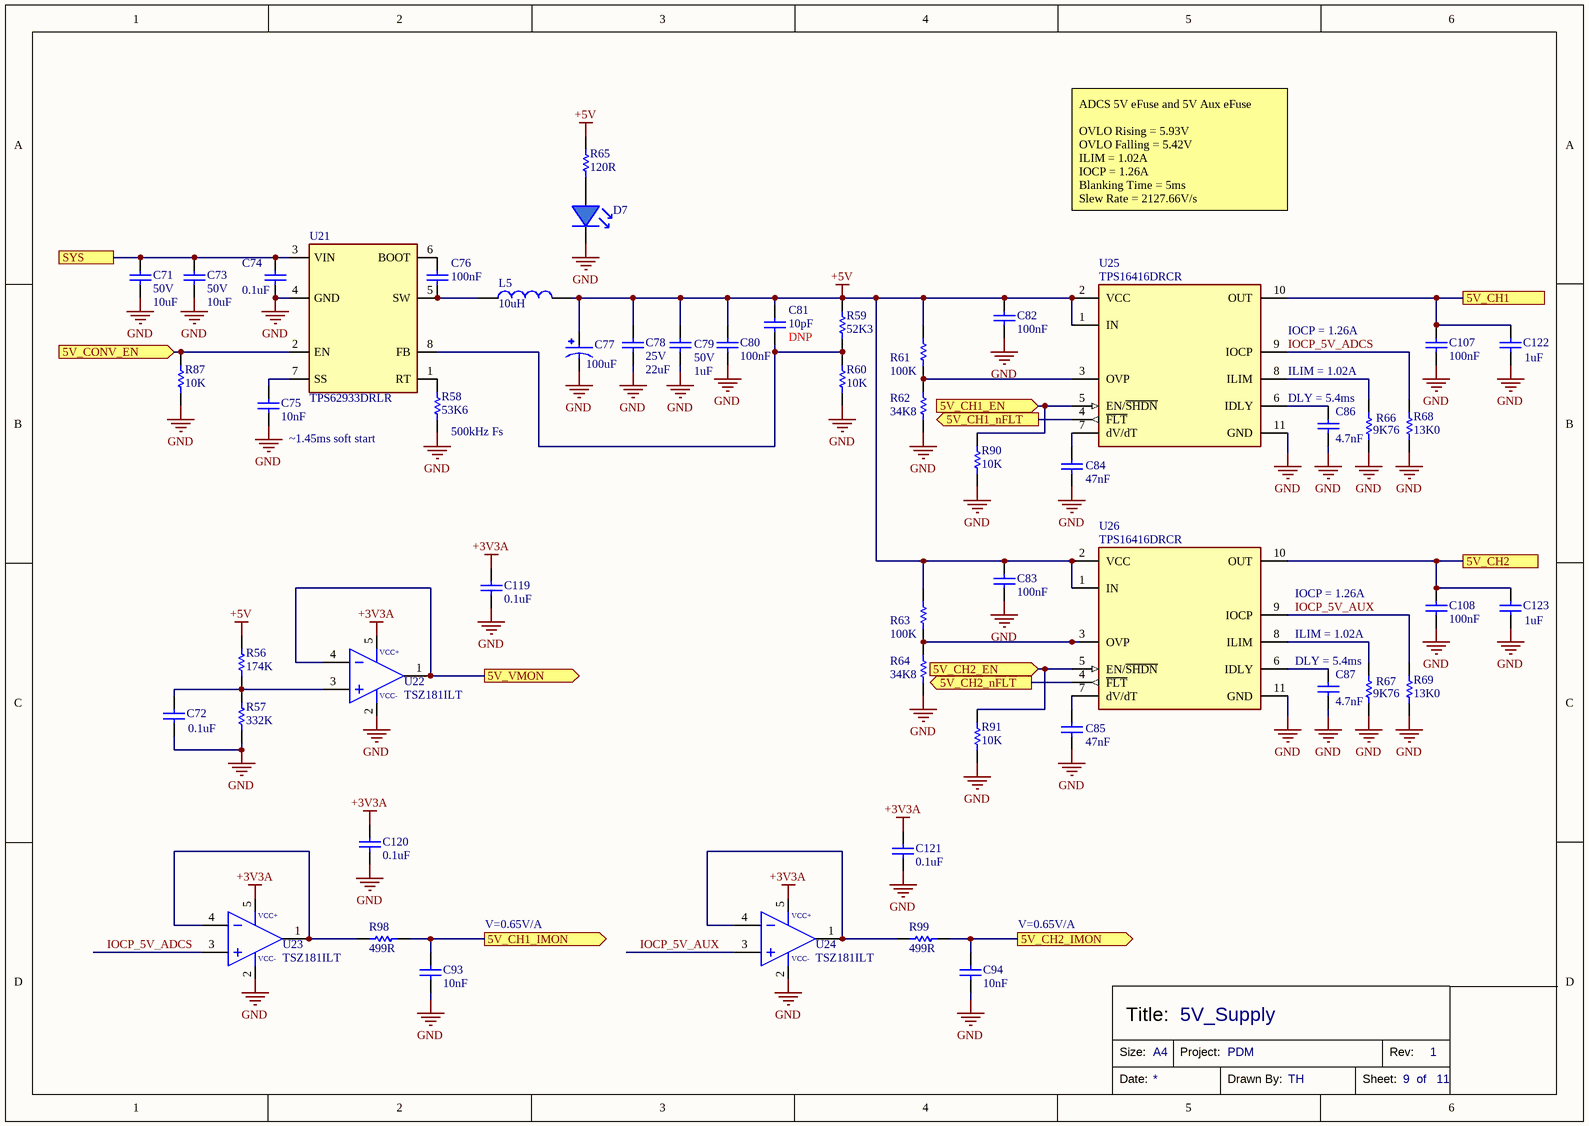
[diagram p8: 5V_Supply.SchDoc]

### Parts
C71  Voltage Rating: 50V  Capacitance: 10uF  [CAPC1210X090]  (hidden comment: CL32B106KBJNNNE)
C72  Capacitance: 0.1uF  [CAPC0805X060]  (hidden comment: CL21B104KACNNNC)
C73  Voltage Rating: 50V  Capacitance: 10uF  [CAPC1210X090]  (hidden comment: CL32B106KBJNNNE)
C74  Capacitance: 0.1uF  [CAPC0402X020]  (hidden comment: CL05B104KB5NNNC)
C75  Capacitance: 10nF  [CAPC0805X060]  (hidden comment: CL21B103KBANNNC)
C76  Capacitance: 100nF  [CAPC0603X040]  (hidden comment: C0603C104K5RACTU)
C77  Capacitance: 100uF  [2312 Tantalum]  (hidden comment: TPSC107K010R0100)
C78  Voltage Rating: 25V  Capacitance: 22uF  [CAPC1210X090]  (hidden comment: CL32B226KAJNNNE)
C79  Voltage Rating: 50V  Capacitance: 1uF  [CAPC0805X060]  (hidden comment: CL21B105KBFNNNE)
C80  Capacitance: 100nF  [CAPC0603X040]  (hidden comment: C0603C104K5RACTU)
C81  Capacitance: 10pF  [CAPC0603X040]  (hidden comment: C0603C104K5RACTU)
C82  Capacitance: 100nF  [CAPC0603X040]  (hidden comment: C0603C104K5RACTU)
C83  Capacitance: 100nF  [CAPC0603X040]  (hidden comment: C0603C104K5RACTU)
C84  Capacitance: 47nF  [CAPC0805X060]  (hidden comment: CL21B473KBCNNNC)
C85  Capacitance: 47nF  [CAPC0805X060]  (hidden comment: CL21B473KBCNNNC)
C86  Capacitance: 4.7nF  [CAPC0805X060]  (hidden comment: CL21B105KAFNNNE)
C87  Capacitance: 4.7nF  [CAPC0805X060]  (hidden comment: CL21B105KAFNNNE)
C93  Capacitance: 10nF  [CAPC0805X060]  (hidden comment: CL21B103KBANNNC)
C94  Capacitance: 10nF  [CAPC0805X060]  (hidden comment: CL21B103KBANNNC)
C107  Capacitance: 100nF  [CAPC0603X040]  (hidden comment: C0603C104K5RACTU)
C108  Capacitance: 100nF  [CAPC0603X040]  (hidden comment: C0603C104K5RACTU)
C119  Capacitance: 0.1uF  [CAPC0603X040]  (hidden comment: C0603C104K5RACTU)
C120  Capacitance: 0.1uF  [CAPC0603X040]  (hidden comment: C0603C104K5RACTU)
C121  Capacitance: 0.1uF  [CAPC0603X040]  (hidden comment: C0603C104K5RACTU)
C122  Capacitance: 1uF  [CAPC0805X060]  (hidden comment: CL21B105KAFNNNE)
C123  Capacitance: 1uF  [CAPC0805X060]  (hidden comment: CL21B105KAFNNNE)
D7  LSM0805463V  [LEDB_0805]  (value not drawn)
L5  Inductance: 10uH  [1274AS-H-100M=P3]  (hidden comment: 1274AS-H-100M=P3)
R56  Resistance: 174K  [RESC0603]  (hidden comment: RMCF0603FT174K)
R57  Resistance: 332K  [RESC0805]  (hidden comment: RMCF0805FT332K)
R58  Resistance: 53K6  [RESC0805]  (hidden comment: RMCF0805FT53K6)
R59  Resistance: 52K3  [RESC0603]  (hidden comment: RMCF0603FT52K3)
R60  Resistance: 10K  [RESC0603]  (hidden comment: RMCF0603FT10K0)
R61  Resistance: 100K  [RESC0805]  (hidden comment: RMCF0805FG100K)
R62  Resistance: 34K8  [RESC0805]  (hidden comment: RMCF0805FT34K8)
R63  Resistance: 100K  [RESC0805]  (hidden comment: RMCF0805FG100K)
R64  Resistance: 34K8  [RESC0805]  (hidden comment: RMCF0805FT34K8)
R65  Resistance: 120R  [RESC0805]  (hidden comment: RMCF0805FT120R)
R66  Resistance: 9K76  [RESC0805]  (hidden comment: RMCF0805FT9K76)
R67  Resistance: 9K76  [RESC0805]  (hidden comment: RMCF0805FT9K76)
R68  Resistance: 13K0  [RESC0805]  (hidden comment: RMCF0805FT13K0)
R69  Resistance: 13K0  [RESC0805]  (hidden comment: RMCF0805FT13K0)
R87  Resistance: 10K  [RESC0805]  (hidden comment: RMCF0805FT10K0)
R90  Resistance: 10K  [RESC0805]  (hidden comment: RMCF0805FT10K0)
R91  Resistance: 10K  [RESC0805]  (hidden comment: RMCF0805FT10K0)
R98  Resistance: 499R  [RESC0805]  (hidden comment: RMCF0805FT499R)
R99  Resistance: 499R  [RESC0805]  (hidden comment: RMCF0805FT499R)
U21  TPS62933DRLR  [SOT-583]
U22  TSZ181ILT  [SOT23-5 IC]
U23  TSZ181ILT  [SOT23-5 IC]
U24  TSZ181ILT  [SOT23-5 IC]
U25  Part Number: TPS16416DRCR  [TPS1641]  (hidden comment: TPS16410DRCR)
U26  Part Number: TPS16416DRCR  [TPS1641]  (hidden comment: TPS16410DRCR)

### Ports
5V_CH1 (see PDM[6B], PC104[4B], PC104[5B]), 5V_CH1_EN (in, see PDM[5B], Controller[3C]), 5V_CH1_IMON (out, see PDM[5B], Controller[1B]), 5V_CH1_nFLT (out, see PDM[5B], Controller[3C]), 5V_CH2 (see PDM[6B], PC104[2B], PC104[3B], PC104[4B], PC104[5B]), 5V_CH2_EN (in, see PDM[5B], Controller[1C]), 5V_CH2_IMON (out, see PDM[5B], Controller[1B]), 5V_CH2_nFLT (out, see PDM[5B], Controller[1C]), 5V_CONV_EN (in, see PDM[5B], Controller[3D]), 5V_VMON (out, see PDM[5B], Controller[3B]), SYS (see PDM[5B], 3V3_Supply[1B], 6V_Supply[1B], 12V_Supply[1A], PC104[4C], PC104[5C])

### Nets
+3V3A: C119.2 C120.2 C121.2 U22.5(VCC+) U23.5(VCC+) U24.5(VCC+)
+5V: C77.1 C78.2 C79.2 C80.2 C81.2 C82.2 C83.2 L5.2 R56.2 R59.2 R61.2 R63.2 R65.2 U25.1(IN) U25.2(VCC) U26.1(IN) U26.2(VCC)
GND: C71.1 C72.1 C73.1 C74.1 C75.1 C77.2 C78.1 C79.1 C80.1 C82.1 C83.1 C84.1 C85.1 C86.1 C87.1 C93.1 C94.1 C107.1 C108.1 C119.1 C120.1 C121.1 C122.1 C123.1 D7.K R57.1 R58.1 R60.1 R62.1 R64.1 R66.1 R67.1 R68.1 R69.1 R87.1 R90.1 R91.1 U21.4(GND) U22.2(VCC-) U23.2(VCC-) U24.2(VCC-) U25.11(GND) U26.11(GND)
IOCP_5V_ADCS: R68.2 U23.3(IN+) U25.9(IOCP)
IOCP_5V_AUX: R69.2 U24.3(IN+) U26.9(IOCP)
NetC26_2: C71.2 C73.2 C74.2 U21.3(VIN) ; port SYS
NetC72_2: C72.2 R56.1 R57.2 U22.3(IN+)
NetC75_2: C75.2 U21.7(SS)
NetC76_1: C76.1 L5.1 U21.5(SW)
NetC76_2: C76.2 U21.6(BOOT)
NetC81_1: C81.1 R59.1 R60.2 U21.8(FB)
NetC84_2: C84.2 U25.7(dV/dT)
NetC85_2: C85.2 U26.7(dV/dT)
NetC86_2: C86.2 U25.6(IDLY)
NetC87_2: C87.2 U26.6(IDLY)
NetC93_2: C93.2 R98.2 ; port 5V_CH1_IMON
NetC94_2: C94.2 R99.2 ; port 5V_CH2_IMON
NetC107_2: C107.2 C122.2 U25.10(OUT) ; port 5V_CH1
NetC108_2: C108.2 C123.2 U26.10(OUT) ; port 5V_CH2
NetD7_A: D7.A R65.1
NetR58_2: R58.2 U21.1(RT)
NetR61_1: R61.1 R62.2 U25.3(OVP)
NetR63_1: R63.1 R64.2 U26.3(OVP)
NetR66_2: R66.2 U25.8(ILIM)
NetR67_2: R67.2 U26.8(ILIM)
NetR87_2: R87.2 U21.2(EN) ; port 5V_CONV_EN
NetR90_2: R90.2 U25.5(EN/~{SHDN}) ; port 5V_CH1_EN
NetR91_2: R91.2 U26.5(EN/~{SHDN}) ; port 5V_CH2_EN
NetR98_1: R98.1 U23.1(OUT) U23.4(IN-)
NetR99_1: R99.1 U24.1(OUT) U24.4(IN-)
NetU3_33: U26.4(~{FLT}) ; port 5V_CH2_nFLT
NetU3_36: U22.1(OUT) U22.4(IN-) ; port 5V_VMON
NetU3_44: U25.4(~{FLT}) ; port 5V_CH1_nFLT

### Notes on the sheet
- ADCS 5V eFuse and 5V Aux eFuse
  OVLO Rising = 5.93V
  OVLO Falling = 5.42V
  ILIM = 1.02A
  IOCP = 1.26A
  Blanking Time = 5ms
  Slew Rate = 2127.66V/s
- (near C81) DNP
- (near U25) IOCP = 1.26A
- DLY = 5.4ms
- ILIM = 1.02A
- ~1.45ms soft start
- (near R58) 500kHz Fs
- (near U26) IOCP = 1.26A
- V=0.65V/A
- 5V_Supply
- Size:
- Title:
- A4
- Project:
- Rev:
- Date:
- Drawn By:
- Sheet:
- of

### Library data of the parts
C71 C73 = CL32B106KBJNNNE: 10 µF ±10% 50V Ceramic Capacitor X7R 1210 (3225 Metric); Manufacturer Part Number: CL32B106KBJNNNE; Distributor Part Number: 1276-3387-1-ND; Tolerance: 10%; Case Code: 1210; Distributor: Digikey
C72 = CL21B104KACNNNC: 0.1uF ±10% 25V Ceramic Capacitor X7R 0805 (2012 Metric); Part Number: CL21B104KACNNNC; Distributor Part Number: 1276-1099-1-ND; Tolerance: 10%; Case Code: 0805; Distributor: Digikey; Voltage Rating: 25V
C74 = CL05B104KB5NNNC: 0.1 µF ±10% 50V Ceramic Capacitor X7R 0402 (1005 Metric); Part Number: CL05B104KB5NNNC; Tolerance: 10%; Distributor Part Number: 1276-CL05B104KB5NNNCCT-ND; Case Code: 0402; Distributor: Digikey; Voltage Rating: 50V
C75 C93 C94 = CL21B103KBANNNC: 10nF ±10% 50V Ceramic Capacitor X7R 0805 (2012 Metric); Voltage Rating: 25V; Part Number: CL21B103KBANNNC; Distributor Part Number: 1276-1015-1-ND; Tolerance: 10%; Case Code: 0805; Distributor: Digikey
C76 C80 C82 C83 C107 C108 C119-C121 = C0603C104K5RACTU: 0.1 µF ±10% 50V Ceramic Capacitor X7R 0603 (1608 Metric); Distributor Part Number: 399-C0603C104K5RACTUCT-ND; Tolerance: 10%; Case Code: 0603; Distributor: Digikey; Voltage Rating: 50V
  C76: Manufacturer Part Number: C0603C104K5RACTU
  C80 C82 C83 C107 C108 C119-C121: Part Number: C0603C104K5RACTU
C77 = TPSC107K010R0100: 100 µF Molded Tantalum Capacitors 10 V 2312 (6032 Metric) 100mOhm; Voltage Rating: 10V; Part Number: TPSC107K010R0100; Distributor: Digikey; Distributor Part Number: 478-1765-1-ND; ESR: 100mOhm; Operating Temperature: -55°C ~ 125°C
C78 = CL32B226KAJNNNE: 22 µF ±10% 25V Ceramic Capacitor X7R 1210 (3225 Metric); Part Number: CL32B226KAJNNNE; Distributor Part Number: 1276-3392-1-ND; Tolerance: 10%; Case Code: 1210; Distributor: Digikey
C79 = CL21B105KBFNNNE: 1uF 50V X7R ±10% 0805 Multilayer Ceramic Capacitors MLCC - SMD/SMT ROHS; Part Number: CL21B105KBFNNNE; Distributor Part Number: 1276-1029-1-ND; Tolerance: 10%; Case Code: 0805; Distributor: Digikey
C81 = C0603C100J5GACTU: 10 pF ±5% 50V Ceramic Capacitor C0G, NP0 0603 (1608 Metric); Tolerance: 10%; Part Number: C0603C100J5GACTU; Distributor Part Number: 399-C0603C100J5GACTUCT-ND; Case Code: 0603; Distributor: Digikey; Voltage Rating: 50V
C84 C85 = CL21B473KBCNNNC: 0.047 µF ±10% 50V Ceramic Capacitor X7R 0805 (2012 Metric); Voltage Rating: 25V; Part Number: CL21B473KBCNNNC; Distributor Part Number: 1276-1250-1-ND; Tolerance: 10%; Case Code: 0805; Distributor: Digikey
C86 C87 = CL21B472KBANNNC: 4.7nF ±10% 50V Ceramic Capacitor X7R 0805 (2012 Metric); Voltage Rating: 25V; Part Number: CL21B472KBANNNC; Distributor Part Number: 1276-1155-1-ND; Tolerance: 10%; Case Code: 0805; Distributor: Digikey
C122 C123 = CL21B105KAFNNNE: 1uF ±10% 25V Ceramic Capacitor X7R 0805 (2012 Metric); Part Number: CL21B105KAFNNNE; Distributor Part Number: 1276-1066-1-ND; Tolerance: 10%; Case Code: 0805; Distributor: Digikey; Voltage Rating: 25V
D7 = LEDB0805: Blue 469nm LED Indication - Discrete 3V 0805 (2012 Metric); Manufacturer Part Number: LSM0805463V; Distributor Part Number: 28-LSM0805463VCT-ND; Colour: Blue; Operating Temperature: *; Voltage - Forward: 3V; Distributor: Digikey
L5 = 1274AS-H-100M=P3: Inductor 10 µH , 4.4 A 30.4mOhm Max Shielded Drum Core; Current Rating: 4.4A; Saturation Current: 6.2A; Part Number: 1274AS-H-100M=P3; Distributor Part Number: 490-10846-1-ND; Distributor: Digikey; DCR: 30.4mOhm
R56 = RMCF0603FT174K: 174 kOhms ±1% 0.1W, 1/10W Chip Resistor 0603 (1608 Metric) Automotive AEC-Q200 Thick Film; Manufacturer Part Number: RMCF0603FT174K; Tolerance: 1%; Distributor: Digikey; Distributor Part Number: RMCF0603FT174KCT-ND; Case Code: 0603
R57 = RMCF0805FT332K: 332 kOhms ±1% 0.125W, 1/8W Chip Resistor 0805 (2012 Metric) Automotive AEC-Q200 Thick Film; Part Number: RMCF0805FT332K; Tolerance: 1%; Distributor Part Number: RMCF0805FT332KCT-ND; Distributor: Digikey; Case Code: 0805
R58 = RMCF0805FT53K6: 53.6 kOhms ±1% 0.125W, 1/8W Chip Resistor 0805 (2012 Metric) Automotive AEC-Q200 Thick Film; Part Number: RMCF0805FT53K6; Tolerance: 1%; Distributor Part Number: RMCF0805FT53K6CT-ND; Distributor: Digikey; Case Code: 0805
R59 = RMCF0603FT52K3: 52.3 kOhms ±1% 0.1W, 1/10W Chip Resistor 0603 (1608 Metric) Automotive AEC-Q200 Thick Film; Part Number: RMCF0603FT52K3; Tolerance: 1%; Distributor: Digikey; Distributor Part Number: RMCF0603FT174KCT-ND; Case Code: 0603
R60 = RMCF0603FT10K0: 10 kOhms ±1% 0.1W, 1/10W Chip Resistor 0603 (1608 Metric) Automotive AEC-Q200 Thick Film; Tolerance: 1%; Distributor Part Number: RMCF0603FT10K0CT-ND; Distributor: Digikey; Case Code: 0603; Part Number: RMCF0603FT10K0
R61 R63 = RMCF0805FG100K: 100 kOhms ±1% 0.125W, 1/8W Chip Resistor 0805 (2012 Metric) Automotive AEC-Q200 Thick Film; Part Number: RMCF0805FG100K; Tolerance: 1%; Distributor Part Number: RMCF0805FG100KCT-ND; Distributor: Digikey; Case Code: 0805
R62 R64 = RMCF0805FT34K8: 34.8 kOhms ±1% 0.125W, 1/8W Chip Resistor 0805 (2012 Metric) Automotive AEC-Q200 Thick Film; Part Number: RMCF0805FT34K8; Tolerance: 1%; Distributor Part Number: RMCF0805FT34K8CT-ND; Distributor: Digikey; Case Code: 0805
R65 = RMCF0805FT120R: 120 Ohms ±1% 0.125W, 1/8W Chip Resistor 0805 (2012 Metric) Automotive AEC-Q200 Thick Film; Part Number: RMCF0805FT120R; Tolerance: 1%; Distributor Part Number: 738-RMCF0805FT120RCT-ND; Distributor: Digikey; Case Code: 0805
R66 R67 = RMCF0805FT9K76: 9.76 kOhms ±1% 0.125W, 1/8W Chip Resistor 0805 (2012 Metric) Automotive AEC-Q200 Thick Film; Part Number: RMCF0805FT9K76; Tolerance: 1%; Distributor Part Number: RMCF0805FT9K76CT-ND; Distributor: Digikey; Case Code: 0805
R68 R69 = RMCF0805FT13K0: 13 kOhms ±1% 0.125W, 1/8W Chip Resistor 0805 (2012 Metric) Automotive AEC-Q200 Thick Film; Part Number: RMCF0805FT13K0; Tolerance: 1%; Distributor Part Number: RMCF0805FT13K0CT-ND; Distributor: Digikey; Case Code: 0805
R87 R90 R91 = RMCF0805FT10K0: 10 kOhms ±1% 0.125W, 1/8W Chip Resistor 0805 (2012 Metric) Automotive AEC-Q200 Thick Film; Part Number: RMCF0805FT10K0; Tolerance: 1%; Distributor Part Number: RMCF0805FT10K0CT-ND; Distributor: Digikey; Case Code: 0805
R98 R99 = RMCF0805FT499R: 499 Ohms ±1% 0.125W, 1/8W Chip Resistor 0805 (2012 Metric) Automotive AEC-Q200 Thick Film; Part Number: RMCF0805FT499R; Tolerance: 1%; Distributor Part Number: RMCF0805FT499RCT-ND; Distributor: Digikey; Case Code: 0805
U21 = TPS62933DRLR: Buck Switching Regulator IC Positive Adjustable 0.8V 1 Output 3A SOT-583; Voltage - Input (Min): 3.8V; Voltage - Input (Max): 30V; Voltage - Output (Max): 22V; Part Number: TPS62933DRLR; Distributor Part Number: 296-TPS62933DRLRCT-ND; Distributor: Digikey; Operating Temperature: -40°C ~ 150°C (TJ); Current Output: 3A; Voltage - Output (Min): 0.8V
U22-U24 = TSZ181ILT: Operational Amplifier, General Purpose, 2.2V~5.5V; Voltage Supply (Min): 2.2V; Voltage Supply (Max): 5.5V; Slew Rate: 4.7V/us; Gain Bandwidth Product: 3MHz; Part Number: TSZ181ILT; Distributor: Digikey; Distributor Part Number: 497-18084-1-ND; Operating Temperature: -40°C ~ 125°C
U25 U26 = TPS16410DRCR: 2.7-V to 40-V 152-mΩ 1.8-A eFuse with output power limiting; Qualification: None; Current - Output: 1.8A; Voltage - Input: 2.7V ~ 40V; Distributor Part Number: 296-TPS16410DRCRCT-ND; Package: 10-VSON (3x3); Distributor: Digikey; Operating Temperature: -40C ~ 125C

## Sheet Heater_Driver.SchDoc
size 297 x 209 mm; SheetNumber: 10; SheetTotal: 11
Used 2 times, as channels PDM/Heater_1, PDM/Heater_2. Parts and nets are listed once, with the designators drawn on the sheet.
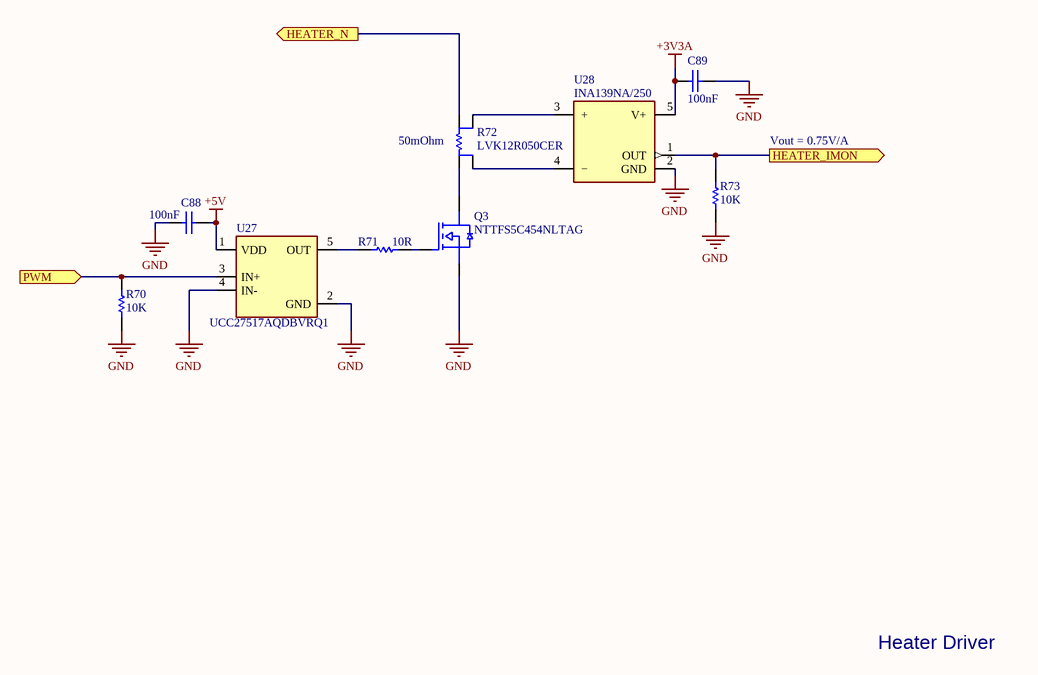
[diagram p9: Heater_Driver.SchDoc]

### Parts
C88  Capacitance: 100nF  [CAPC0603X040]  (hidden comment: C0603C104K5RACTU)
C89  Capacitance: 100nF  [CAPC0603X040]  (hidden comment: C0603C104K5RACTU)
Q3  NTTFS5C454NLTAG  [NTTFS5C454NLTAG]
R70  Resistance: 10K  [RESC0805]  (hidden comment: RMCF0805FT10K0)
R71  Resistance: 10R  [RESC0603]  (hidden comment: RNCF0603AKT10R0)
R72  LVK12R050CER  Resistance: 50mOhm  [LVK12R050CER-2]
R73  Resistance: 10K  [RESC0805]  (hidden comment: RMCF0805FT10K0)
U27  UCC27517AQDBVRQ1  [SOT23-5 IC]
U28  INA139NA/250  [SOT23-5 IC]

### Ports
HEATER_IMON (out, see PDM[2B]), HEATER_N (out, see PDM[1A]), PWM (in, see PDM[2B])

### Nets
+3V3A: C89.2 U28.5(V+)
+5V: C88.2 U27.1(VDD)
GND: C88.1 C89.1 Q3.S R70.1 R73.1 U27.2(GND) U27.4(IN-) U28.2(GND)
HEATER_IMON: R73.2 U28.1(OUT) ; port HEATER_IMON
HEATER_N: R72.1 ; port HEATER_N
PWM: R70.2 U27.3(IN+) ; port PWM
NetQ3_D: Q3.D R72.4
NetQ3_G: Q3.G R71.2
NetR71_1: R71.1 U27.5(OUT)
NetR72_2: R72.2 U28.3(+)
NetR72_3: R72.3 U28.4(−)

### Channels
PDM/Heater_1: designators end in A; ports HEATER_IMON=NetR73A_2 HEATER_N=NetR72A_1 PWM=NetR70A_2
PDM/Heater_2: designators end in B; ports HEATER_IMON=NetR73A_2 HEATER_N=NetR72A_1 PWM=NetR70A_2

### Notes on the sheet
- Vout = 0.75V/A
- Heater Driver
- Size:
- Title:
- A4
- Project:
- Rev:
- Date:
- Drawn By:
- Sheet:
- of

### Library data of the parts
C88 C89 = C0603C104K5RACTU: as C76 on sheet 5V_Supply; Tolerance: 10%; Distributor Part Number: 399-C0603C104K5RACTUCT-ND; Case Code: 0603; Voltage Rating: 50V; Distributor: Digikey; Part Number: C0603C104K5RACTU
Q3 = NTTFS5C454NLTAG: N-MOSFET 40 V , 85 A, 3.8 mΩ Rds(on) @ 10 V, WDFN-8 3.3×3.3 mm, low Qg (~18 nC); Manufacturer: Onsemi; Vdss: 40V; Current - Continuous Drain (Id): 20A; Rds On (Max): 3.8mOhm; Gate Charge (Qg) (Max) @ Vgs: 18nC @ 10V; Vgs (Max): 20V; Power Dissipation (Max) (Ta): 3.2W; Part Number: NTTFS5C454NL; Distributor: Digikey; Distributor Part Number: NTTFS5C454NLTAGOSCT-ND; Operating Temperature: -55°C ~ 175°C; ComponentLink1Description: Datasheet; ComponentLink1URL: https://www.onsemi.com/pdf/datasheet/nttfs5c454nl-d.pdf
R70 R73 = RMCF0805FT10K0: as R87 on sheet 5V_Supply; Tolerance: 1%; Distributor Part Number: RMCF0805FT10K0CT-ND; Case Code: 0805; Distributor: Digikey; Part Number: RMCF0805FT10K0
R71 = RESC0603: 10 Ohms ±0.05% 0.1W, 1/10W Chip Resistor 0603 (1608 Metric) Automotive AEC-Q200 Thin Film; Manufacturer Part Number: RNCF0603AKT10R0; Tolerance: 0.05%; Distributor Part Number: RNCF0603AKT10R0CT-ND; Distributor: Digikey; Case Code: 0603
R72 = LVK12R050CER: Resistor, Current Sense 50 mOhms ±0.25% 0.5W, Moisture Resistant Thick Film; Manufacturer: Ohmite; Temperature Coefficient: ±50ppm/°C; Part Number: LVK12R050CER; Distributor: Digikey; Distributor Part Number: 273-LVK12R050CERCT-ND; Power: 0.5W; Tolerance: 0.25%
U27 = UCC27517AQDBVRQ1: Low-Side Gate Driver IC Inverting, Non-Inverting SOT-23-5; Rise / Fall Time (Typ): 8ns, 7ns; VIL: 1V; VIH: 2.4V; Voltage Supply: 4.5V ~ 18V; Current - Peak Output: 4A; Part Number: UCC27517AQDBVRQ1; Distributor: Digikey; Distributor Part Number: 296-41038-1-ND; Operating Temperature: -40°C ~ 150°C
U28 = INA139NA/250: 40V Current Sense Amplifier 1 Circuit 8-MSOP; Accuracy: 0.5%; Distributor: Digikey; Distributor Part Number: INA139NA/250CT-ND; Operating Temperature: -40°C ~ 125°C; Part Number: INA139NA/250

## Sheet PC104.SchDoc
size 297 x 209 mm; SheetNumber: 11; SheetTotal: 11
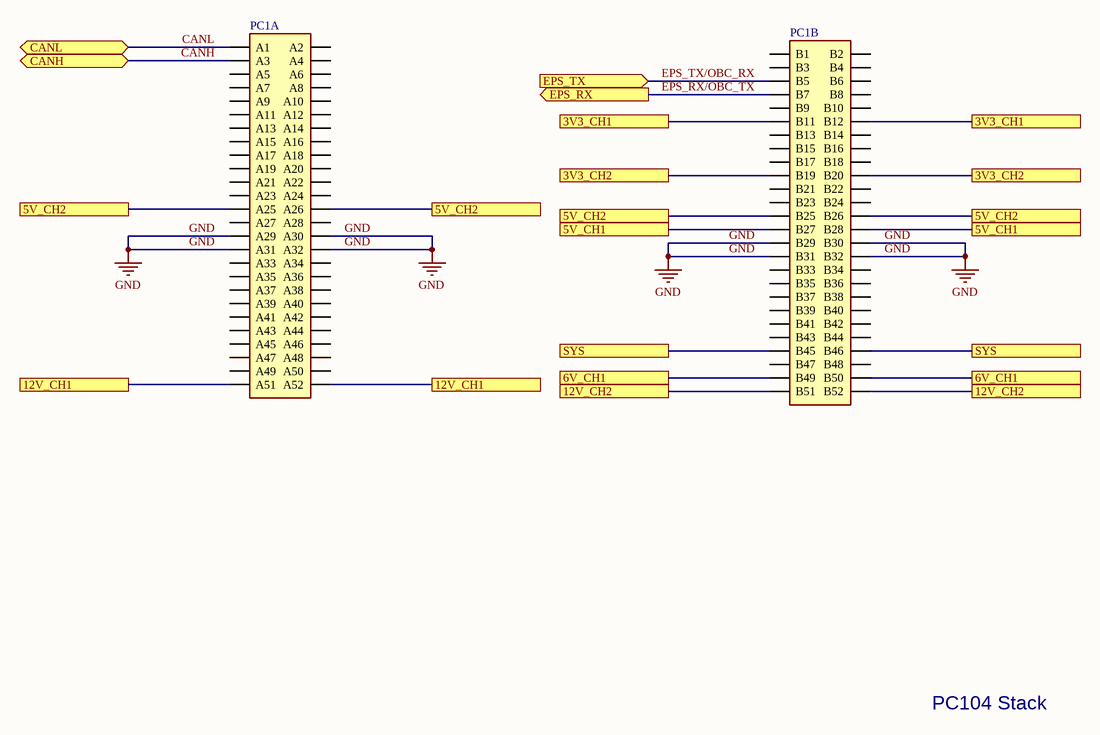
[diagram p10: PC104.SchDoc]

### Parts
PC1  SSQ-126-21-G-D  [PC104 STACK HEADER]  (value not drawn)  (parts A,B of 2)

### Ports
3V3_CH1 (see PDM[2C], 3V3_Supply[6B]), 3V3_CH2 (see PDM[2C], 3V3_Supply[6C]), 5V_CH1 (see PDM[2C], 5V_Supply[6B]), 5V_CH2 (see PDM[2C], 5V_Supply[6B]), 6V_CH1 (see PDM[2C], 6V_Supply[6B]), 12V_CH1 (see PDM[2C], 12V_Supply[6B]), 12V_CH2 (see PDM[2C], 12V_Supply[6C]), CANH (bidir, see PDM[3C], Controller[6C]), CANL (bidir, see PDM[3C], Controller[6C]), EPS_RX (out, see PDM[3C], Controller[3B]), EPS_TX (in, see PDM[3C], Controller[3B]), SYS (see PDM[2C], 3V3_Supply[1B], 5V_Supply[1A], 6V_Supply[1B], 12V_Supply[1A])

### Nets
GND: PC1.A29 PC1.A30 PC1.A31 PC1.A32 PC1.B29 PC1.B30 PC1.B31 PC1.B32
CANH: PC1.A3 ; port CANH
CANL: PC1.A1 ; port CANL
EPS_RX/OBC_TX: PC1.B7 ; port EPS_RX
EPS_TX/OBC_RX: PC1.B5 ; port EPS_TX
NetC26_2: PC1.B45 PC1.B46 ; port SYS
NetC102_2: PC1.B19 PC1.B20 ; port 3V3_CH2
NetC103_2: PC1.B11 PC1.B12 ; port 3V3_CH1
NetC104_2: PC1.B49 PC1.B50 ; port 6V_CH1
NetC105_2: PC1.A51 PC1.A52 ; port 12V_CH1
NetC106_2: PC1.B51 PC1.B52 ; port 12V_CH2
NetC107_2: PC1.B27 PC1.B28 ; port 5V_CH1
NetC108_2: PC1.A25 PC1.A26 PC1.B25 PC1.B26 ; port 5V_CH2

Not connected (* = marked no-connect by the designer): PC1 A2 A4 A5 A6 A7 A8 A9 A10 A11 A12 A13 A14 A15 A16 A17 A18 A19 A20 A21 A22 A23 A24 A27 A28 A33 A34 A35 A36 A37 A38 A39 A40 A41 A42 A43 A44 A45 A46 A47 A48 A49 A50 B1 B2 B3 B4 B6 B8 B9 B10 B13 B14 B15 B16 B17 B18 B21 B22 B23 B24 B33 B34 B35 B36 B37 B38 B39 B40 B41 B42 B43 B44 B47 B48

### Notes on the sheet
- PC104 Stack
- Size:
- Title:
- A4
- Project:
- Rev:
- Date:
- Drawn By:
- Sheet:
- of

### Library data of the parts
PC1 = PC104: PC104 stack header, 2.54mm 4x26positions; Current Rating: 6.3A; Number of Positions: 52; Voltage Rating (AC): 465V; Voltage Rating (DC): 655V; Part Number: SSQ-126-21-G-D; Distributor Part Number: SSQ-126-21-G-D-ND; Distributor: Digikey; Operating Temperature: -55°C ~ 125°C; Number of Rows: 2